# Altium project PCB.PrjPcb
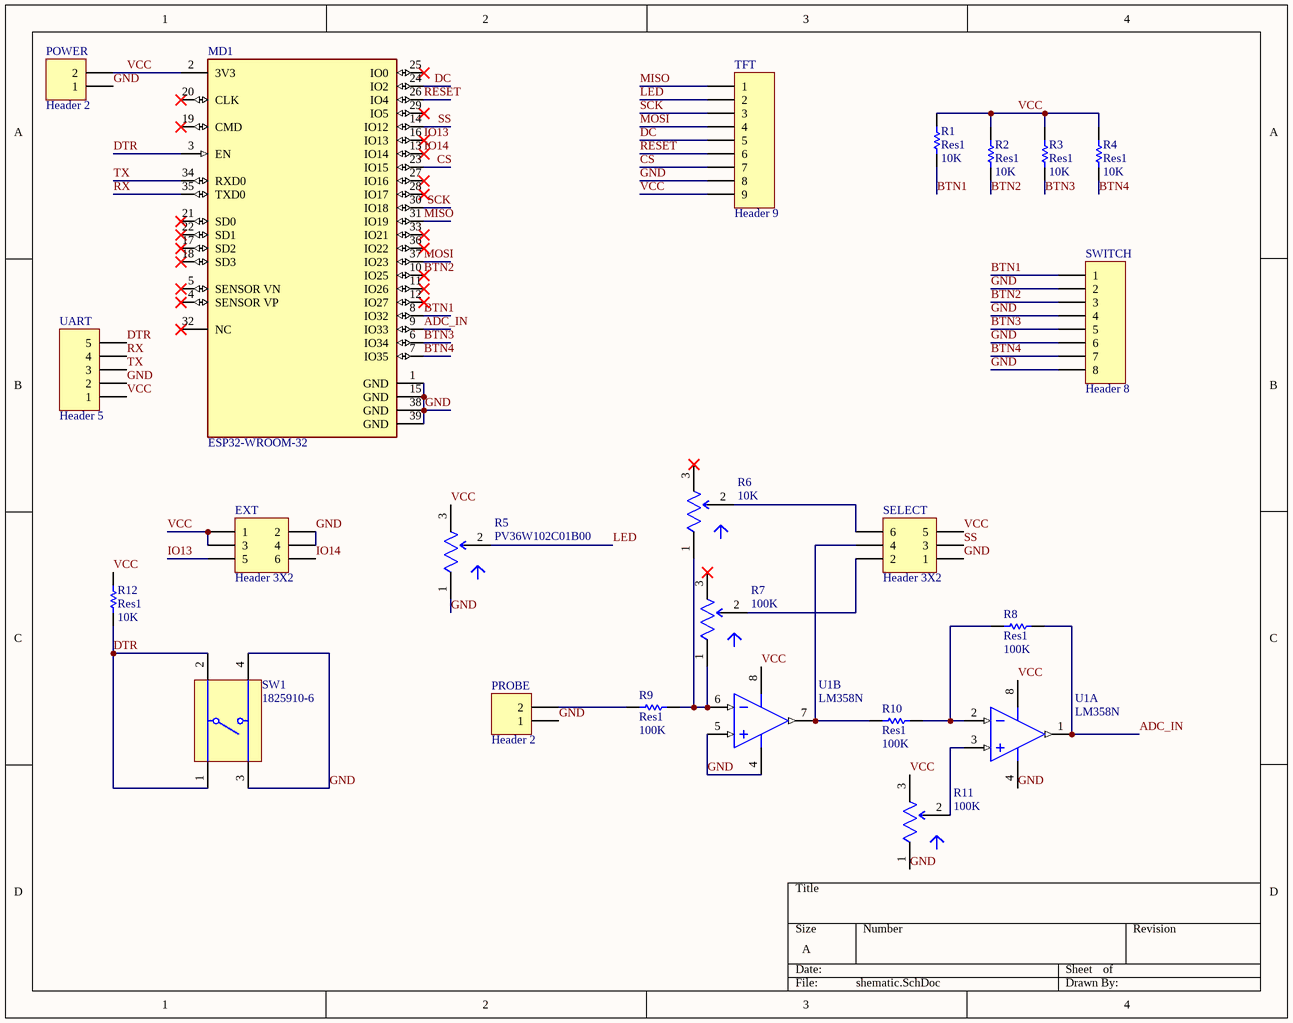
[diagram p0: shematic.SchDoc]
1 sheet, 22 parts. Net scope: global (net labels, ports and power ports of the same name join across sheets).
Board file: PCB.PcbDoc

## Sheet shematic.SchDoc
size A; SheetNumber: 1; SheetTotal: 1

### Parts
EXT  Header 3X2  [HDR2X3]
MD1  ESP32-WROOM-32  [FP-ESP32-WROOM-32-MFG]
POWER  Header 2  [HDR1X2]
PROBE  Header 2  [HDR1X2]
R1  Res1  value 10K  [AXIAL-0.3]
R2  Res1  value 10K  [AXIAL-0.3]
R3  Res1  value 10K  [AXIAL-0.3]
R4  Res1  value 10K  [AXIAL-0.3]
R5  PV36W102C01B00  [FP-PV36W-MFG]
R6  10K  [FP-PV36W-MFG]
R7  100K  [FP-PV36W-MFG]
R8  Res1  value 100K  [AXIAL-0.3]
R9  Res1  value 100K  [AXIAL-0.3]
R10  Res1  value 100K  [AXIAL-0.3]
R11  100K  [FP-PV36W-MFG]
R12  Res1  value 10K  [AXIAL-0.3]
SELECT  Header 3X2  [HDR2X3]
SW1  1825910-6  [TECO-1825910-6_V]
SWITCH  Header 8  [HDR1X8]
TFT  Header 9  [HDR1X9]
U1  LM358N  [ONSC-PDIP-8-626-05_M]  (parts A,B of 2)
UART  Header 5  [HDR1X5]

### Nets
ADC_IN: MD1.9(IO33) R8.1 U1.1(OUTA)
BTN1: MD1.8(IO32) R1.1 SWITCH.1
BTN2: MD1.10(IO25) R2.1 SWITCH.3
BTN3: MD1.6(IO34) R3.1 SWITCH.5
BTN4: MD1.7(IO35) R4.1 SWITCH.7
CS: MD1.23(IO15) TFT.7
DC: MD1.24(IO2) TFT.5
DTR: MD1.3(EN) R12.2 SW1.1 SW1.2 UART.5
GND: EXT.2 EXT.4 MD1.1(GND) MD1.15(GND) MD1.38(GND) MD1.39(GND) POWER.1 PROBE.1 R5.1 R11.1 SELECT.1 SW1.3 SW1.4 SWITCH.2 SWITCH.4 SWITCH.6 SWITCH.8 TFT.8 U1.4(VEE/GND) U1.5(INB+) UART.2
IO13: EXT.5 MD1.16(IO13)
IO14: EXT.6 MD1.13(IO14)
LED: R5.2(Wiper) TFT.2
MISO: MD1.31(IO19) TFT.1
MOSI: MD1.37(IO23) TFT.4
RESET: MD1.26(IO4) TFT.6
RX: MD1.35(TXD0) UART.4
SCK: MD1.30(IO18) TFT.3
SS: MD1.14(IO12) SELECT.3
TX: MD1.34(RXD0) UART.3
VCC: EXT.1 EXT.3 MD1.2(3V3) POWER.2 R1.2 R2.2 R3.2 R4.2 R5.3 R11.3 R12.1 SELECT.5 TFT.9 U1.8(VCC) UART.1
NetPROBE_2: PROBE.2 R9.2
NetR6_1: R6.1 R7.1 R9.1 U1.6(INB-)
NetR6_2: R6.2(Wiper) SELECT.6
NetR7_2: R7.2(Wiper) SELECT.2
NetR8_2: R8.2 R10.1 U1.2(INA-)
NetR10_2: R10.2 SELECT.4 U1.7(OUTB)
NetR11_2: R11.2(Wiper) U1.3(INA+)

Not connected (* = marked no-connect by the designer): MD1 4(SENSOR_VP)* 5(SENSOR_VN)* 11(IO26)* 12(IO27)* 17(SD2)* 18(SD3)* 19(CMD)* 20(CLK)* 21(SD0)* 22(SD1)* 25(IO0)* 27(IO16)* 28(IO17)* 29(IO5)* 32(NC)* 33(IO21)* 36(IO22)*; R6 3*; R7 3*

### Library data of the parts
EXT SELECT = Header 3X2: Header, 3-Pin, Dual row; LatestRevisionDate: 17-Jul-2002; LatestRevisionNote: Re-released for DXP Platform.; Publisher: Altium Limited
MD1 = CMP-194065-000008-1: RX TXRX MOD WIFI SURFACE MOUNT; Frequency: 2.5GHz; Sensitivity: -98dBm; Operating Supply Voltage: 3.6V; Data Rate: 150Mbps; Weight: 0.088185oz; Package Quantity: 550; Min Operating Temperature: -40°C; Mount: Surface Mount; Max Operating Temperature: 85°C; Packaging: Cut Tape; Case/Package: SMD/SMT
POWER PROBE = Header 2: Header, 2-Pin; LatestRevisionDate: 17-Jul-2002; LatestRevisionNote: Re-released for DXP Platform.; Publisher: Altium Limited
R1-R4 R8-R10 R12 = Res1: Resistor; Published: 8-Jun-2000; LatestRevisionDate: 17-Jul-2002; LatestRevisionNote: Re-released for DXP Platform.; PackageReference: AXIAL-0.3; Publisher: Altium Limited; PackageDescription: Axial Device, Thru-Hole; 2 Leads; 0.3 in Pin Spacing
R5 = CMP-07234-000009-1: TRIMMER 1K OHM 0.5W PC PIN TOP; Manufacturer: Bourns; Temperature Coefficient: 100ppm/°C; Standoff Height: 0.38mm; Resistance: 1kΩ; Tolerance: 10%; Value: 1kΩ; Octopart: https://octopart.com/pv36w102c01b00-bourns-71612321; ComponentLink2URL: https://www.bourns.com/docs/Product-Datasheets/pv36.pdf; Category: Res; Manufacturer Part Number: PV36W102C01B00; RoHS: TRUE; Device Class L1: Passive Components; Height: 12.05mm; ComponentLink2Description: Datasheet; Mouser Description: Trimmer Resistors - Through Hole 1.0Kohms 10mm Square 25turn; Package: PV36W; Device Class L2: Resistors; Power Rating: 0.5W; Digikey Description: TRIMMER 1K OHM 0.5W PC PIN TOP; Automotive: No; Temperature Range High: +125°C; Series: PV36; Temperature Range Low: -55°C; Temperature: -55°C to +125°C; Device Class L3: Variable Resistors and Potentiometers; Composition: Cermet; Lead Free: Yes
R6 R7 R11 = CMP-07234-000009-1: TRIMMER 1K OHM 0.5W PC PIN TOP; Manufacturer Part Number: PV36W102C01B00; Manufacturer: Bourns; Temperature Coefficient: 100ppm/°C; Standoff Height: 0.38mm; Resistance: 1kΩ; Tolerance: 10%; Value: 1kΩ; Octopart: https://octopart.com/pv36w102c01b00-bourns-71612321; ComponentLink2URL: https://www.bourns.com/docs/Product-Datasheets/pv36.pdf; Category: Res; RoHS: TRUE; Device Class L1: Passive Components; Height: 12.05mm; ComponentLink2Description: Datasheet; Mouser Description: Trimmer Resistors - Through Hole 1.0Kohms 10mm Square 25turn; Package: PV36W; Device Class L2: Resistors; Power Rating: 0.5W; Digikey Description: TRIMMER 1K OHM 0.5W PC PIN TOP; Automotive: No; Temperature Range High: +125°C; Series: PV36; Temperature Range Low: -55°C; Temperature: -55°C to +125°C; Device Class L3: Variable Resistors and Potentiometers; Composition: Cermet; Lead Free: Yes
SW1 = CMP-1684-00021-1: Tact Switch, SPST-NO, 0.05 A, -35 to 85 degC, 4-Pin THD, RoHS, Bulk; Manufacturer: TE Connectivity; Maximum Contact Resistance: 100mOhm; Mechanical Life: 100000Cycles; Bushing Type: Unthreaded; Switch Configuration: OFF(ON); Maximum DC Voltage Rating: 24V; Contact Rating @ Voltage: 0.05A@24VDC; Actuator Color: Black; Body Orientation: Straight; Function: MomentaryContact; Illumination: N/R; Actuator Style: RoundButton; Actuator Material: PolybutyleneTerephthalate; Dielectric Strength: 500VAC; Pole Throw Configuration: SPST; Actuator Length: 1.4mm; Product Weight: N/A; Contact Material: CopperAlloy; Housing Material: N/A; Terminal Type: PCPins; Minimum Insulation Resistance: 100MOhm; Package Description: 4-Pin Through Hole Device, Body 5.99 x 5.99 mm, Pitch 6.5 mm; Part No: 1825910-6; Package Reference: THD; Base Material: N/A; Manufacturer URL: http://www.te.com; Contact Plating: Silver; RoHS: Yes; Datasheet Version: Rev. C9; Electrical Life: 100000Cycles; Maximum AC Voltage Rating: N/A; Thread Size: N/R; Operating Temperature: -35to85C; Mounting: ThroughHole; Dimension: 5.99x5mm; Datasheet URL: http://www.te.com/commerce/DocumentDelivery/DDEController?Action=showdoc&DocId=Customer+Drawing%7F1825910%7FC9%7Fpdf%7FEnglish%7FENG_CD_1825910_C9.pdf%7F1825910-6; Family: 1825910; Seal Location: N/A; Seal Description: N/A; Packaging: N/A
SWITCH = Header 8: Header, 8-Pin; LatestRevisionDate: 17-Jul-2002; LatestRevisionNote: Re-released for DXP Platform.; Publisher: Altium Limited
TFT = Header 9: Header, 9-Pin; LatestRevisionDate: 17-Jul-2002; LatestRevisionNote: Re-released for DXP Platform.; Publisher: Altium Limited
U1 = CMP-1310-00098-1: Single Supply Dual Operational Amplifier, 3 to 32 V, 0 to 70 degC, 8-Pin PDIP, Tube; Manufacturer: On Semiconductor; VCC Max (V): 32; VCC Min (V): 3; Mounting Technology: Through Hole; ComponentLink3Description: Package Specification; ComponentLink3URL: http://www.onsemi.com/pub_link/Collateral/LM211-D.PDF; RoHS: FALSE; Packing: Tube; PackageDescription: 8-Pin Plastic Dual-In Line Package, Body 9.52 x 6.605 mm, Pitch 2.54 mm; PackageReference: PDIP-8-626-05; PackageVersion: Rev. M, 04/2010; PartNumber: LM358N; ComponentLink2Description: Datasheet; ComponentLink2URL: http://www.onsemi.cn/pub_link/Collateral/LM358-D.PDF; ComponentLink1URL: http://www.onsemi.com/; ComponentLink1Description: Manufacturer URL; DatasheetVersion: Rev. 27
UART = Header 5: Header, 5-Pin; LatestRevisionDate: 17-Jul-2002; LatestRevisionNote: Re-released for DXP Platform.; Publisher: Altium Limited